# Altium schematic sheet Sheet1.SchDoc
size A4
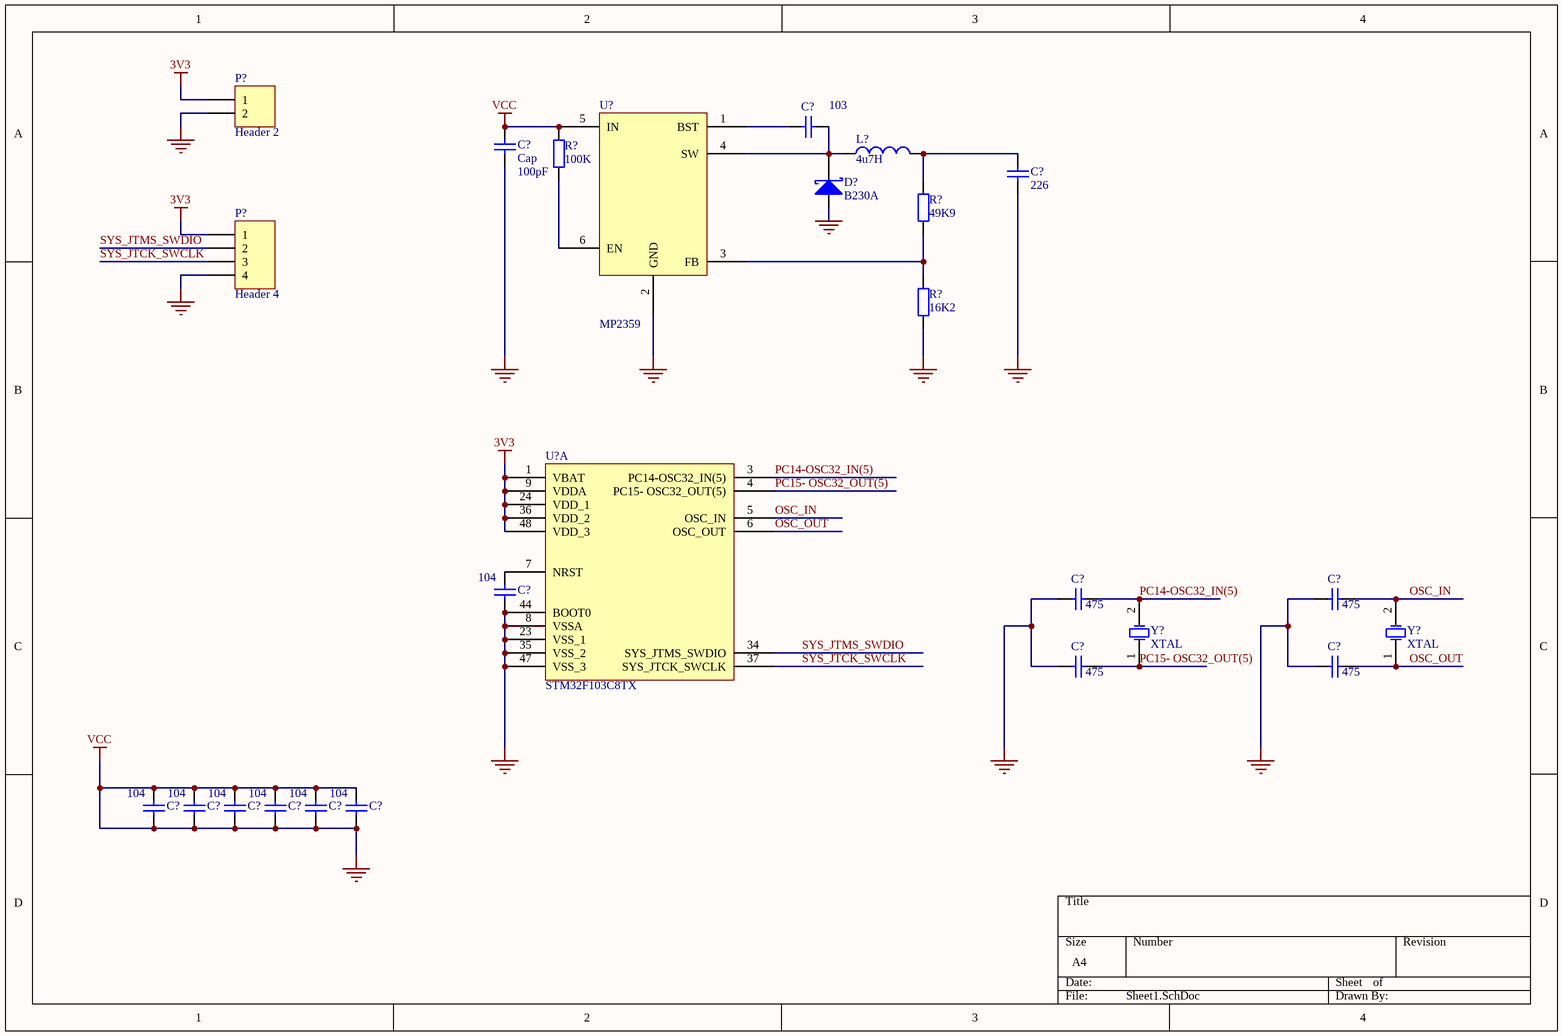
[diagram p0: Sheet1.SchDoc]

## Parts
(Parts that share a designator on the sheet are numbered #1, #2 ... from top to bottom, then left to right.)
C?#1  value 103  [RAD-0.3]
C?#2  Cap  value 100pF  [RAD-0.3]
C?#3  226  [RAD-0.3]
C?#4  value 104  [RAD-0.3]
C?#5  value 475  [RAD-0.3]
C?#6  value 475  [RAD-0.3]
C?#7  value 475  [RAD-0.3]
C?#8  value 475  [RAD-0.3]
C?#9  value 104  [RAD-0.3]
C?#10  value 104  [RAD-0.3]
C?#11  value 104  [RAD-0.3]
C?#12  value 104  [RAD-0.3]
C?#13  value 104  [RAD-0.3]
C?#14  value 104  [RAD-0.3]
D?  B230A  [SMB]
L?  value 4u7H  [0402-A]
P?#1  Header 2  [HDR1X2]
P?#2  Header 4  [HDR1X4]
R?#1  100K  [AXIAL-0.4]
R?#2  49K9  [AXIAL-0.4]
R?#3  16K2  [AXIAL-0.4]
U?#1  MP2359
U?#2  STM32F103C8TX  (part A of 2)
Y?#1  XTAL  [R38]
Y?#2  XTAL  [R38]

## Nets
3V3: P?#1.1 P?#2.1 U?#2.1(VBAT) U?#2.9(VDDA) U?#2.24(VDD_1) U?#2.36(VDD_2) U?#2.48(VDD_3)
GND: C?#2.1 C?#2.2 C?#3.1 C?#4.1 C?#5.2 C?#6.2 C?#7.2 C?#8.2 C?#9.1 C?#9.2 C?#10.1 C?#10.2 C?#11.1 C?#11.2 C?#12.1 C?#12.2 C?#13.1 C?#13.2 C?#14.1 C?#14.2 D?.1(A) P?#1.2 P?#2.4 R?#1.2 R?#3.1 U?#1.2(GND) U?#1.5(IN) U?#2.8(VSSA) U?#2.23(VSS_1) U?#2.35(VSS_2) U?#2.44(BOOT0) U?#2.47(VSS_3)  [also labelled VCC]
OSC_IN: C?#6.1 U?#2.5(OSC_IN) Y?#2.2(OSC2)
OSC_OUT: C?#8.1 U?#2.6(OSC_OUT) Y?#2.1(OSC1)
PC14-OSC32_IN(5): C?#5.1 U?#2.3(PC14-OSC32_IN(5)) Y?#1.2(OSC2)
PC15- OSC32_OUT(5): C?#7.1 U?#2.4(PC15-_OSC32_OUT(5)) Y?#1.1(OSC1)
SYS_JTCK_SWCLK: P?#2.3 U?#2.37(SYS_JTCK_SWCLK)
SYS_JTMS_SWDIO: P?#2.2 U?#2.34(SYS_JTMS_SWDIO)
NetC?#1_1: C?#1.1 U?#1.1(BST)
NetC?#1_2: C?#1.2 D?.2(K) L?.1 U?#1.4(SW)
NetC?#3_2: C?#3.2 L?.2 R?#2.2
NetC?#4_2: C?#4.2 U?#2.7(NRST)
NetR?#1_1: R?#1.1 U?#1.6(EN)
NetR?#2_1: R?#2.1 R?#3.2 U?#1.3(FB)

## Library data of the parts
C?#1 C?#2 C?#4-C?#14 = Cap: Capacitor; Published: 8-Jun-2000; LatestRevisionDate: 17-Jul-2002; LatestRevisionNote: Re-released for DXP Platform.; PackageReference: RAD-0.3; Publisher: Altium Limited; PackageDescription: Radial Cap, Thru-Hole; 2 Leads; 0.3 in Pin Spacing
C?#3 = Cap: Capacitor; Value: 100pF; Published: 8-Jun-2000; LatestRevisionDate: 17-Jul-2002; LatestRevisionNote: Re-released for DXP Platform.; PackageReference: RAD-0.3; Publisher: Altium Limited; PackageDescription: Radial Cap, Thru-Hole; 2 Leads; 0.3 in Pin Spacing
D? = D Schottky: Schottky Diode; Published: 8-Jun-2000; LatestRevisionDate: 17-Jul-2002; LatestRevisionNote: Re-released for DXP Platform.; PackageReference: SMB; Publisher: Altium Limited; PackageDescription: DO-214-AA/SMB; 2 C-Bend Leads; Body 5.3 x 3.6 mm, inc. leads (LxW); Code_JEDEC: DO-214-AA
L? = Inductor: Code_IEC: 1005; Published: 8-Jun-2000; LatestRevisionDate: 29-May-2009; LatestRevisionNote: IPC-7351 Footprint Added.; PackageReference: 0402-A; Publisher: Altium Limited; PackageDescription: Chip Inductor; Code_JEITA: 0402
P?#1 = Header 2: Header, 2-Pin; LatestRevisionDate: 17-Jul-2002; LatestRevisionNote: Re-released for DXP Platform.; Publisher: Altium Limited
P?#2 = Header 4: Header, 4-Pin; LatestRevisionDate: 17-Jul-2002; LatestRevisionNote: Re-released for DXP Platform.; Publisher: Altium Limited
R?#1 = Res2: Resistor; Published: 8-Jun-2000; LatestRevisionDate: 17-Jul-2002; LatestRevisionNote: Re-released for DXP Platform.; PackageReference: AXIAL-0.4; Publisher: Altium Limited; PackageDescription: Axial Device, Thru-Hole; 2 Leads; 0.4 in Pin Spacing
R?#2 R?#3 = Res2: Resistor; Value: 1K; Published: 8-Jun-2000; LatestRevisionDate: 17-Jul-2002; LatestRevisionNote: Re-released for DXP Platform.; PackageReference: AXIAL-0.4; Publisher: Altium Limited; PackageDescription: Axial Device, Thru-Hole; 2 Leads; 0.4 in Pin Spacing
U?#2 = Component_1
Y?#1 Y?#2 = XTAL: Crystal Oscillator; Published: 8-Jun-2000; LatestRevisionDate: 17-Jul-2002; LatestRevisionNote: Re-released for DXP Platform.; PackageReference: R38; Publisher: Altium Limited; PackageDescription: Crystal, Thru-Hole; 2 Leads; Body 3.1 x 8.2 mm (Dia.xH)